# Altium schematic sheet C-05 CPU PERI2.SchDoc
size 513 x 386 mm
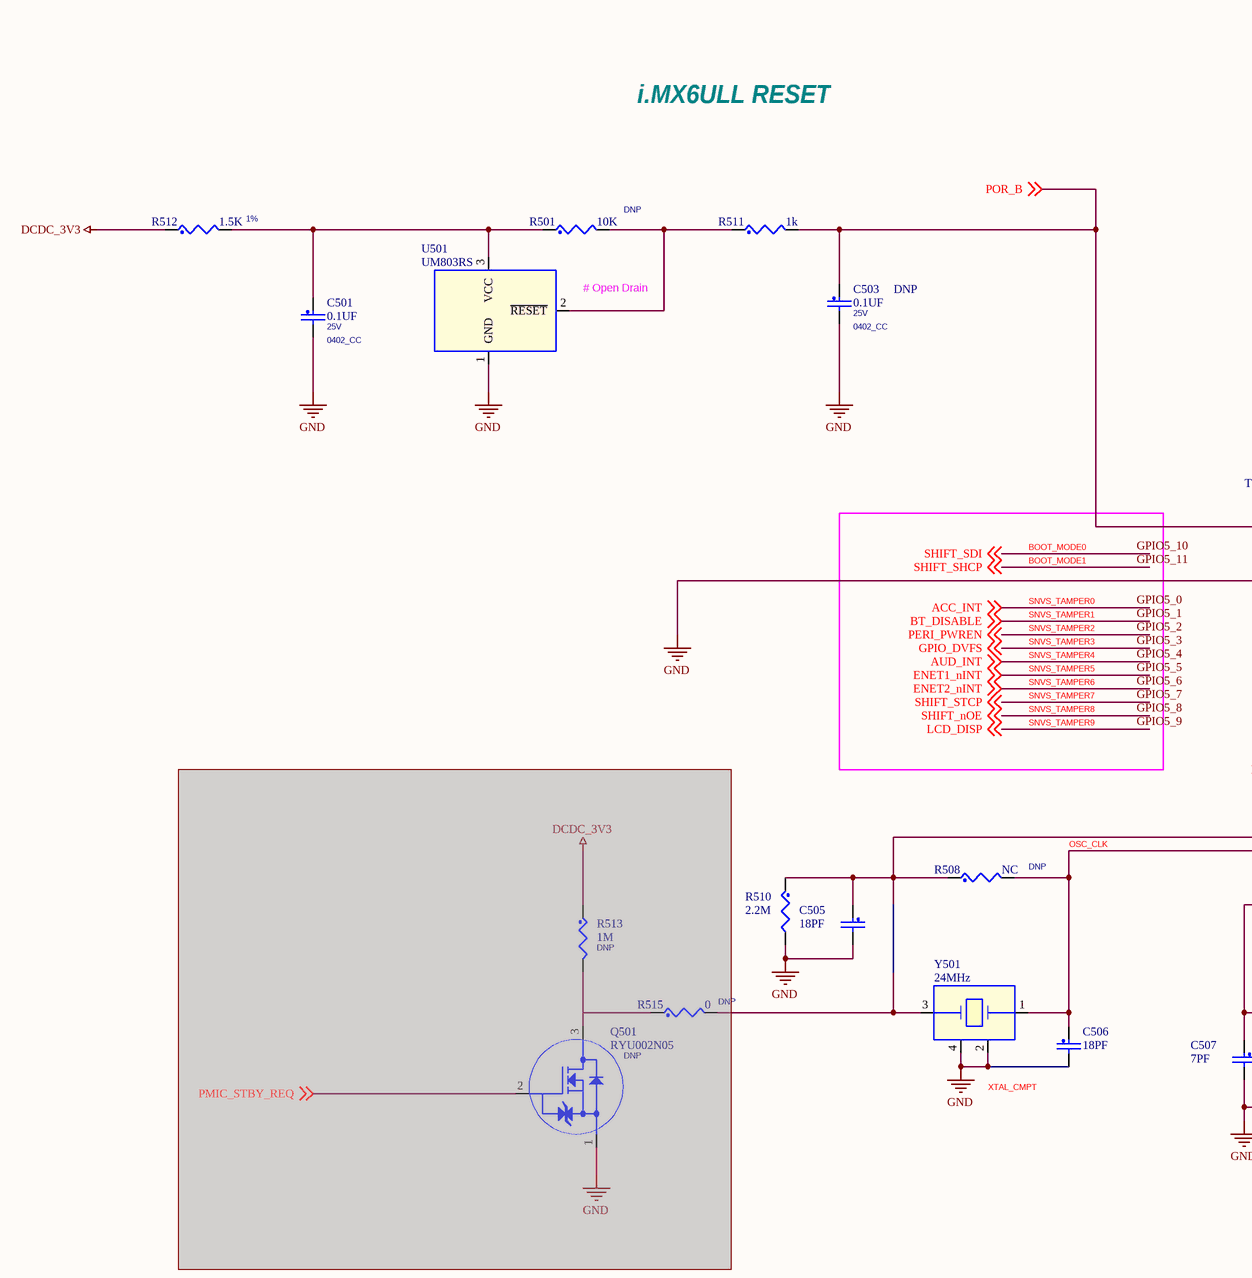
[diagram p0: C-05 CPU PERI2.SchDoc, left]
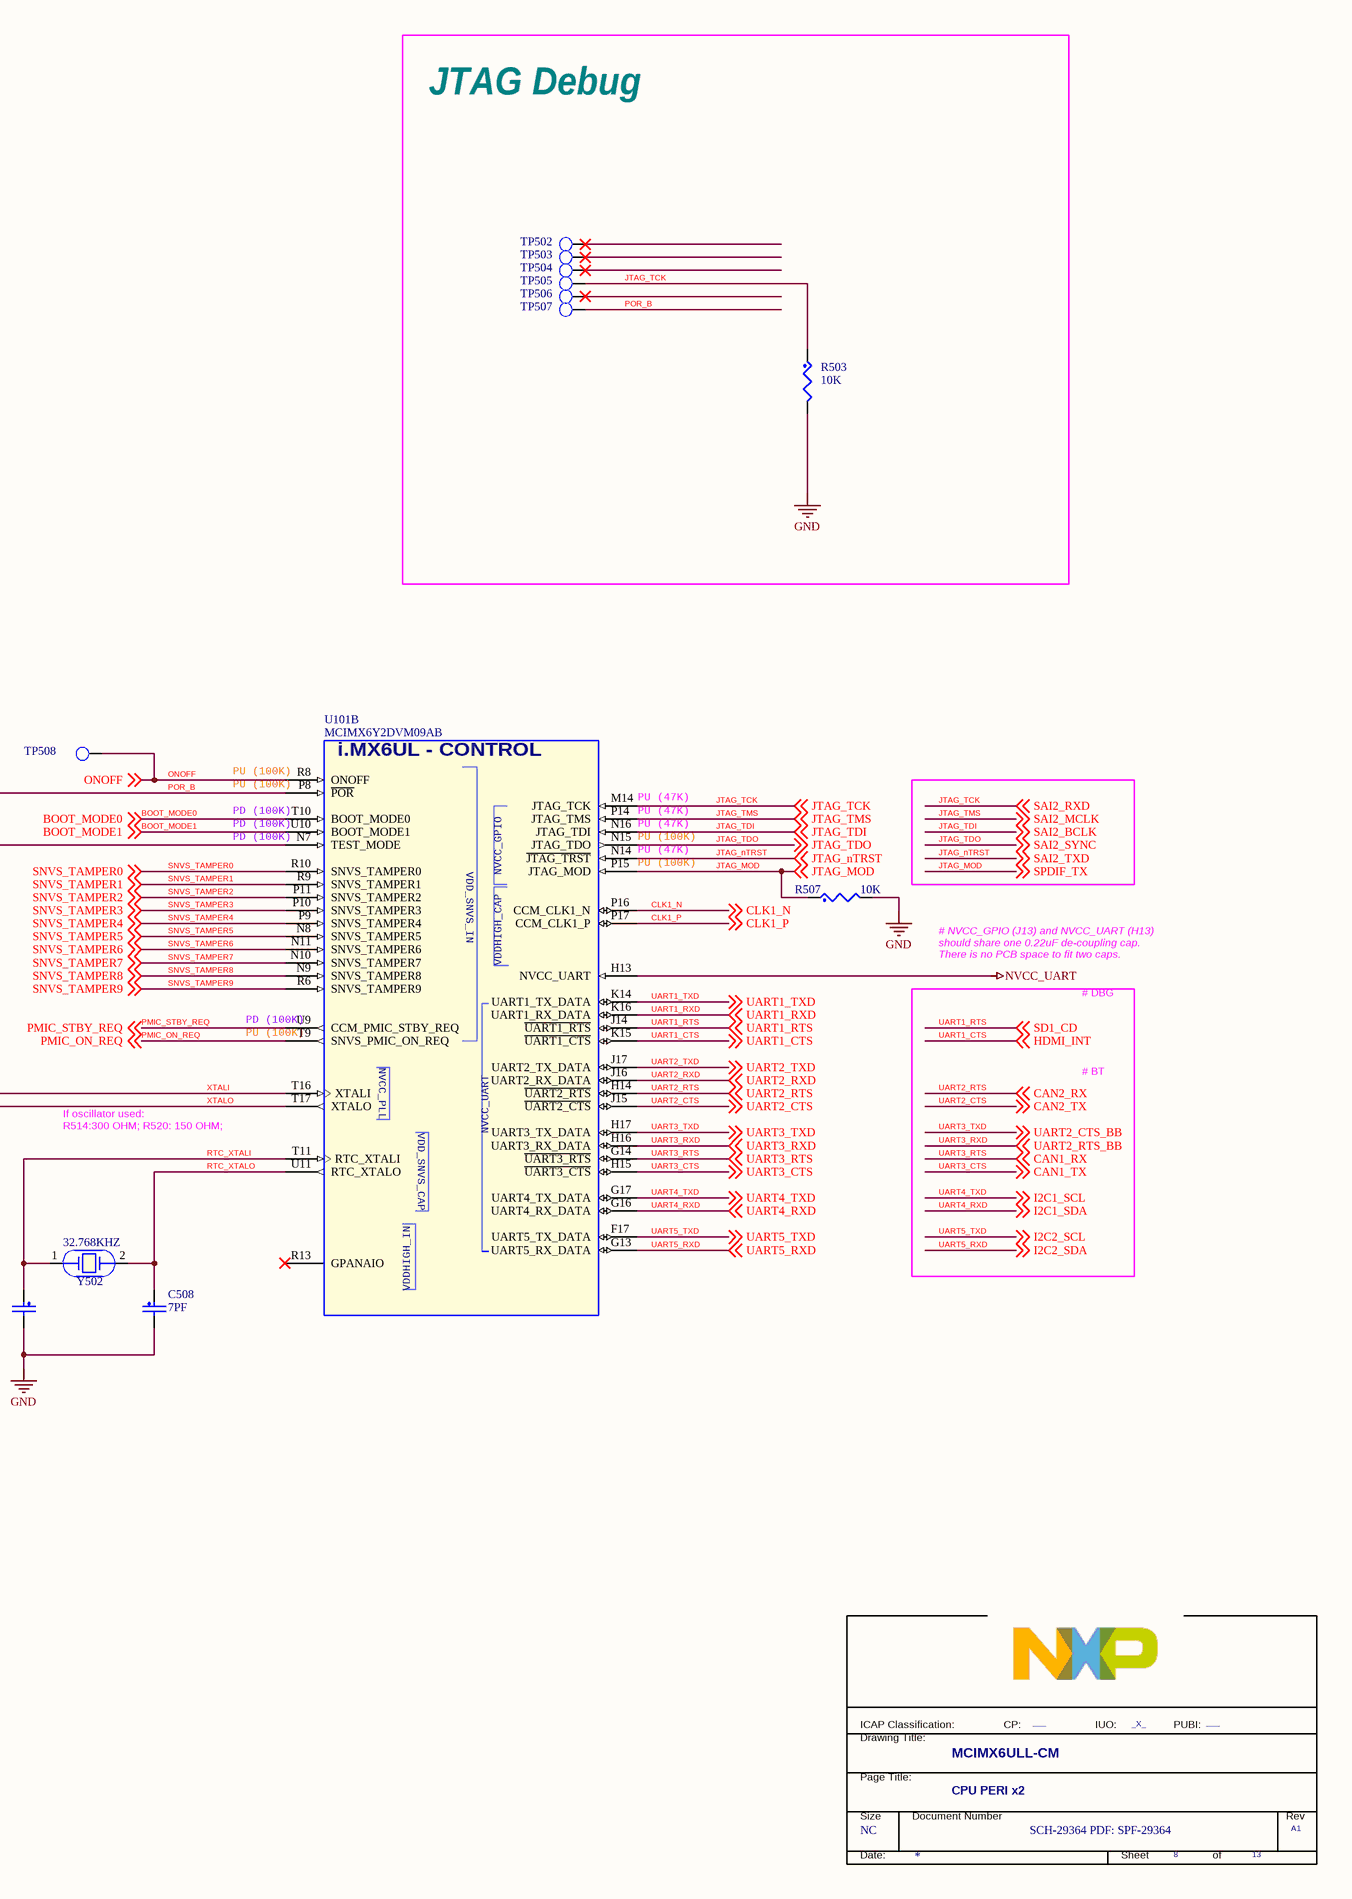
[diagram p1: C-05 CPU PERI2.SchDoc, right]

## Parts
*  PageTitle: CPU PERI x2  Page Count: 13  Page Number: 8  Page Size: NC  Title: MCIMX6ULL-CM  RevCode: A1  Doc: SCH-29364 PDF: SPF-29364  FCP: ___  FIUO: _X_  (hidden comment: TitleBlock_FS)  (graphical)
C501  0.1UF  VOLTAGE: 25V  PCB Footprint: 0402_CC  [0402T_C]
C503  0.1UF  ASSY_OPT: DNP  VOLTAGE: 25V  PCB Footprint: 0402_CC  [0402T_C]
C505  18PF  [0402T_C]
C506  18PF  [0402T_C]
C507  7PF  [0402T_C]
C508  7PF  [0402T_C]
Q501  RYU002N05  ASSY_OPT: DNP  [SOT-23]  (masked out: inside a compile mask, not in the netlist)
R501  10K  ASSY_OPT: DNP  [0402T_C]
R503  10K  [0402T_C]
R507  10K  [0402T_C]
R508  NC  ASSY_OPT: DNP  [0402T_C]
R510  2.2M  [0402T_C]
R511  1k  [0402T_C]
R512  1.5K  Tolerance: 1%  [0402T_C]
R513  1M  ASSY_OPT: DNP  [0402_CC]  (masked out: inside a compile mask, not in the netlist)
R515  0  ASSY_OPT: DNP  [0402_CC]  (masked out: inside a compile mask, not in the netlist)
TP502  TP_35MIL  [testpoint_35mil]  (value not drawn)
TP503  TP_35MIL  [testpoint_35mil]  (value not drawn)
TP504  TP_35MIL  [testpoint_35mil]  (value not drawn)
TP505  TP_35MIL  [testpoint_35mil]  (value not drawn)
TP506  TP_35MIL  [testpoint_35mil]  (value not drawn)
TP507  TP_35MIL  [TPAD_015]  (value not drawn)
TP508  TP_35MIL  [TPAD_015]  (value not drawn)
U101  MCIMX6Y2DVM09AB  [BGA289_0P8_14X14]  (part B of 11)
U501  UM803RS  [sot-23]
Y501  24MHz  [xtlosc4_3p2x2p5mm_sm]
Y502  32.768KHZ  [XTAL2-3p2x1p5-SM]

## Blocks framed on the sheet
JTAG Debug: R503 TP502-TP507

## Nets
DCDC_3V3: R512.1
GND: C501.2 C503.2 C505.2 C506.2 C507.2 C508.2 R503.2 R507.2 R510.2 U101.N7(TEST_MODE) U501.1(GND) Y501.2 Y501.4
NVCC_UART: U101.H13(NVCC_UART)
BOOT_MODE0: U101.T10(BOOT_MODE0) ; off-sheet BOOT_MODE0, off-sheet SHIFT_SDI  [also labelled GPIO5_10, SHIFT_SDI]
BOOT_MODE1: U101.U10(BOOT_MODE1) ; off-sheet BOOT_MODE1, off-sheet SHIFT_SHCP  [also labelled GPIO5_11, SHIFT_SHCP]
CLK1_N: U101.P16(CCM_CLK1_N) ; off-sheet CLK1_N
CLK1_P: U101.P17(CCM_CLK1_P) ; off-sheet CLK1_P
GPIO5_0: U101.R10(SNVS_TAMPER0) ; off-sheet ACC_INT, off-sheet SNVS_TAMPER0  [also labelled ACC_INT, SNVS_TAMPER0]
GPIO5_1: U101.R9(SNVS_TAMPER1) ; off-sheet BT_DISABLE, off-sheet SNVS_TAMPER1  [also labelled BT_DISABLE, SNVS_TAMPER1]
GPIO5_2: U101.P11(SNVS_TAMPER2) ; off-sheet SNVS_TAMPER2, off-sheet PERI_PWREN  [also labelled PERI_PWREN, SNVS_TAMPER2]
GPIO5_3: U101.P10(SNVS_TAMPER3) ; off-sheet SNVS_TAMPER3, off-sheet GPIO_DVFS  [also labelled GPIO_DVFS, SNVS_TAMPER3]
GPIO5_4: U101.P9(SNVS_TAMPER4) ; off-sheet AUD_INT, off-sheet SNVS_TAMPER4  [also labelled AUD_INT, SNVS_TAMPER4]
GPIO5_5: U101.N8(SNVS_TAMPER5) ; off-sheet SNVS_TAMPER5, off-sheet ENET1_nINT  [also labelled ENET1_nINT, SNVS_TAMPER5]
GPIO5_6: U101.N11(SNVS_TAMPER6) ; off-sheet SNVS_TAMPER6, off-sheet ENET2_nINT  [also labelled ENET2_nINT, SNVS_TAMPER6]
GPIO5_7: U101.N10(SNVS_TAMPER7) ; off-sheet SNVS_TAMPER7, off-sheet SHIFT_STCP  [also labelled SHIFT_STCP, SNVS_TAMPER7]
GPIO5_8: U101.N9(SNVS_TAMPER8) ; off-sheet SNVS_TAMPER8, off-sheet SHIFT_nOE  [also labelled SHIFT_nOE, SNVS_TAMPER8]
GPIO5_9: U101.R6(SNVS_TAMPER9) ; off-sheet SNVS_TAMPER9, off-sheet LCD_DISP  [also labelled LCD_DISP, SNVS_TAMPER9]
JTAG_MOD: R507.1 U101.P15(JTAG_MOD) ; off-sheet JTAG_MOD, off-sheet SPDIF_TX  [also labelled SPDIF_TX]
JTAG_nTRST: U101.N14(~{JTAG_TRST}) ; off-sheet SAI2_TXD, off-sheet JTAG_nTRST  [also labelled SAI2_TXD]
JTAG_TCK: R503.1 TP505.1(TP) U101.M14(JTAG_TCK) ; off-sheet SAI2_RXD, off-sheet JTAG_TCK  [also labelled SAI2_RXD]
JTAG_TDI: U101.N16(JTAG_TDI) ; off-sheet SAI2_BCLK, off-sheet JTAG_TDI  [also labelled SAI2_BCLK]
JTAG_TDO: U101.N15(JTAG_TDO) ; off-sheet SAI2_SYNC, off-sheet JTAG_TDO  [also labelled SAI2_SYNC]
JTAG_TMS: U101.P14(JTAG_TMS) ; off-sheet SAI2_MCLK, off-sheet JTAG_TMS  [also labelled SAI2_MCLK]
ONOFF: TP508.1(TP) U101.R8(ONOFF) ; off-sheet ONOFF
OSC_CLK: C506.1 R508.2 U101.T17(XTALO) Y501.1  [also labelled XTALO]
PMIC_ON_REQ: U101.T9(SNVS_PMIC_ON_REQ) ; off-sheet PMIC_ON_REQ
PMIC_STBY_REQ: U101.U9(CCM_PMIC_STBY_REQ) ; off-sheet PMIC_STBY_REQ
POR_B: C503.1 R511.2 TP507.1(TP) U101.P8(~{POR}) ; off-sheet POR_B
RTC_XTALI: C507.1 U101.T11(RTC_XTALI) Y502.1
RTC_XTALO: C508.1 U101.U11(RTC_XTALO) Y502.2
UART1_CTS: U101.K15(~{UART1_CTS}) ; off-sheet HDMI_INT, off-sheet UART1_CTS  [also labelled HDMI_INT]
UART1_RTS: U101.J14(~{UART1_RTS}) ; off-sheet SD1_CD, off-sheet UART1_RTS  [also labelled SD1_CD]
UART1_RXD: U101.K16(UART1_RX_DATA) ; off-sheet UART1_RXD
UART1_TXD: U101.K14(UART1_TX_DATA) ; off-sheet UART1_TXD
UART2_CTS: U101.J15(~{UART2_CTS}) ; off-sheet CAN2_TX, off-sheet UART2_CTS  [also labelled CAN2_TX]
UART2_RTS: U101.H14(~{UART2_RTS}) ; off-sheet CAN2_RX, off-sheet UART2_RTS  [also labelled CAN2_RX]
UART2_RXD: U101.J16(UART2_RX_DATA) ; off-sheet UART2_RXD
UART2_TXD: U101.J17(UART2_TX_DATA) ; off-sheet UART2_TXD
UART3_CTS: U101.H15(~{UART3_CTS}) ; off-sheet CAN1_TX, off-sheet UART3_CTS  [also labelled CAN1_TX]
UART3_RTS: U101.G14(~{UART3_RTS}) ; off-sheet CAN1_RX, off-sheet UART3_RTS  [also labelled CAN1_RX]
UART3_RXD: U101.H16(UART3_RX_DATA) ; off-sheet UART2_RTS_BB, off-sheet UART3_RXD  [also labelled UART2_RTS_BB]
UART3_TXD: U101.H17(UART3_TX_DATA) ; off-sheet UART2_CTS_BB, off-sheet UART3_TXD  [also labelled UART2_CTS_BB]
UART4_RXD: U101.G16(UART4_RX_DATA) ; off-sheet I2C1_SDA, off-sheet UART4_RXD  [also labelled I2C1_SDA]
UART4_TXD: U101.G17(UART4_TX_DATA) ; off-sheet I2C1_SCL, off-sheet UART4_TXD  [also labelled I2C1_SCL]
UART5_RXD: U101.G13(UART5_RX_DATA) ; off-sheet I2C2_SDA, off-sheet UART5_RXD  [also labelled I2C2_SDA]
UART5_TXD: U101.F17(UART5_TX_DATA) ; off-sheet I2C2_SCL, off-sheet UART5_TXD  [also labelled I2C2_SCL]
XTALI: C505.1 R508.1 R510.1 U101.T16(XTALI) Y501.3
NetC501_1: C501.1 R501.1 R512.2 U501.3(VCC)
NetR501_2: R501.2 R511.1 U501.2(~{RESET})

Not connected (* = marked no-connect by the designer): TP502 1(TP)*; TP503 1(TP)*; TP504 1(TP)*; TP506 1(TP)*; U101 R13(GPANAIO)*

## Notes on the sheet
- i.MX6ULL RESET
- (near U501) # Open Drain
- (near U101) PU (100K)
- (near U101) PD (100K)
- (near U101) PU (47K)
- # NVCC_GPIO (J13) and NVCC_UART (H13)
  should share one 0.22uF de-coupling cap.
  There is no PCB space to fit two caps.
- # DBG
- # BT
- If oscillator used:
  R514:300 OHM; R520: 150 OHM;
- Labels drawn without touching a wire or pin: XTAL_CMPT
- (in symbol MCIMX6Y2DVM05AA_PBGA_289P, part B) i.MX6UL - CONTROL; VDDHIGH_CAP; VDDHIGH_IN
- (in symbol TitleBlock_FS) ICAP Classification:; CP:; IUO:; PUBI:; Drawing Title:; Page Title:; Size; Document Number; Rev; Date:; Sheet; of

## Library data of the parts
* = TitleBlock_FS: OrgAddr2: Austin, TX 78735-8598; OrgAddr1: 6501 William Cannon Drive West; OrgName: Freescale Semiconductor; Page Create Date: March  8, 1995; PUBI: ___; Page Modify Date: *
C501 C503 = CAP_NP: CAP CER 0.1UF 25V 10% X5R 0402; CLASS: DISCRETE; FPLIST: CC0402_25,CC0402_HD,0402_CC; CAD_APPROVED: Yes; MFG_PN01: CC0402KRX5R8BB104; MFG_NAME01: YAGEO AMERICA; AGILE_PN: 150-78633; HEIGHT: 0.55MM; ROHS: Yes; Tolerance: 10%
C505 C506 = CAP_NP: CAP CER 18PF 50V 1% C0G 0402; CLASS: DISCRETE; ROOM: ATLAS-AP; PRIORITY_PN: 021-00248; CAD_APPROVED: Yes; MFG_PN01: CC0402FRNPO9BN180; MFG_NAME01: YAGEO; AGILE_PN: 150-76630; FPLIST: CC0402_25,CC0402_HD,0402_CC; PCB Footprint: 0402_CC; VOLTAGE: 50V; HEIGHT: 0.59MM; ROHS: Yes; Tolerance: 1%
C507 C508 = CAP_NP: CAP CER 18PF 50V 1% C0G 0402; CLASS: DISCRETE; FPLIST: CC0402_25,CC0402_HD,0402_CC; AGILE_PN: 150-76630; MFG_NAME01: YAGEO; MFG_PN01: CC0402FRNPO9BN180; CAD_APPROVED: Yes; PRIORITY_PN: 021-00248; ROOM: ATLAS-AP; PCB Footprint: 0402_CC; VOLTAGE: 50V; Tolerance: 1%; ROHS: Yes; HEIGHT: 0.59MM
Q501 = NMOSFET_3P_ESD_DIODE: TRAN NMOS SW 0.9V DRIVE 50V UMT3; CLASS: IC; AGILE_PN: 480-78966; MFG_NAME01: ROHM; CAD_APPROVED: Yes; PCB Footprint: SOT323_3; MFG_PN01: RYU002N05; ROHS: Yes; HEIGHT: 0.9MM
R501 = RES: RES MF ZERO OHM 1/16W 5% 0402; CLASS: DISCRETE; FPLIST: RC0402_25,RC0402_HD,RC0402_X2,0402_CC; CAD_APPROVED: Yes; MFG_PN01: MCR01MZPJ000; MFG_NAME01: ROHM; AGILE_PN: 470-75394; PCB Footprint: 0402_CC; HEIGHT: 0.45 MM; ROHS: Yes; Tolerance: 5%
R503 R507 = RES: RES MF 10K 1/16W 5% 0402; CLASS: DISCRETE; FPLIST: RC0402_25,RC0402_HD,0402_CC; CAD_APPROVED: Yes; MFG_PN01: CRCW040210K0JNED; MFG_NAME01: VISHAY INTERTECHNOLOGY; AGILE_PN: 470-75557; PCB Footprint: 0402_CC; ROHS: Yes; Tolerance: 5%; TOL: 5%; HEIGHT: 0.4 MM
R508 = RES: RES MF 1M 1/10W 5% AEC-Q200 0402; CLASS: DISCRETE; Temp_Range: -55&#8451; to 155&#8451;; FPLIST: RC0402_25,RC0402_HD,0402_CC; CAD_APPROVED: Yes; MFG_PN01: RK73B1ETTP105J; MFG_NAME01: KOA SPEER; AGILE_PN: 470-79978; PCB Footprint: 0402_CC; HEIGHT: 0.4MM; ROHS: Yes; Tolerance: 5%
R510 = RES: RES MF 2.2M 1/10W 1% AEC-Q200 0402; CLASS: DISCRETE; Temp_Range: -55C to +155C; FPLIST: RC0402_25,RC0402_HD,0402_CC; CAD_APPROVED: Yes; MFG_PN01: RK73H1ETTP2204F; MFG_NAME01: KOA SPEER; AGILE_PN: 470-31210; PCB Footprint: 0402_CC; HEIGHT: 0.40 MM; ROHS: Yes; Tolerance: 1%
R511 = RES: RES MF 1.0K 1/16W 5% 0402; CLASS: DISCRETE; AGILE_PN: 470-75555; MFG_NAME01: VISHAY INTERTECHNOLOGY; MFG_PN01: CRCW04021K00JNED; CAD_APPROVED: Yes; FPLIST: RC0402_25,RC0402_HD,RC0402_X2,0402_CC; PCB Footprint: 0402_CC; HEIGHT: 0.41mm; Tolerance: 5%; ROHS: Yes
R512 = RES: RES MF 1.5K 1/16W 1% 0402; CLASS: DISCRETE; AGILE_PN: 470-80487; MFG_NAME01: BOURNS; MFG_PN01: CR0402-FX-1501GLF; CAD_APPROVED: Yes; FPLIST: RC0402_25,RC0402_HD,0402_CC; PCB Footprint: 0402_CC; HEIGHT: 0.4MM; ROHS: Yes
R513 = RES: RES MF 1M 1/10W 5% AEC-Q200 0402; CLASS: DISCRETE; Temp_Range: -55&#8451; to 155&#8451;; AGILE_PN: 470-79978; MFG_NAME01: KOA SPEER; MFG_PN01: RK73B1ETTP105J; CAD_APPROVED: Yes; FPLIST: RC0402_25,RC0402_HD,0402_CC; HEIGHT: 0.4MM; Tolerance: 5%; ROHS: Yes; PCB Footprint: 0402_CC
R515 = RES: RES MF ZERO OHM 1/16W 5% 0402; CLASS: DISCRETE; FPLIST: RC0402_25,RC0402_HD,RC0402_X2,0402_CC; CAD_APPROVED: Yes; MFG_PN01: MCR01MZPJ000; MFG_NAME01: ROHM; AGILE_PN: 470-75394; HEIGHT: 0.45 MM; ROHS: Yes; Tolerance: 5%; PCB Footprint: 0402_CC
TP502-TP506 = T POINT R: TEST POINT PAD .035 SMT, no part to order; CLASS: IC; AGILE_PN: 510-75618; CAD_APPROVED: Yes; ROHS: Yes; HEIGHT: 0.1MM; PCB Footprint: testpoint_35mil
TP507 TP508 = T POINT R: TEST POINT PAD .035 SMT, no part to order; CLASS: IC; AGILE_PN: 510-75618; CAD_APPROVED: Yes; PCB Footprint: testpoint_35mil; ROHS: Yes; HEIGHT: 0.1MM
U101 = MCIMX6Y2DVM05AA_PBGA_289P: IC CPU ARM COREA7 900MHZ 16BIT 3-3.6V PBGA289; AGILE_PN: TMP-WF-33487; MFG_NAME01: NXP SEMICONDUCTORS; Temp_Range: 0C to +95C; PRE_APN: 330-77080; CAD_APPROVED: Yes; CLASS: IC; MFG_PN01: MCIMX6Y2DVM09AB; ROHS: Yes; HEIGHT: 1.32MM; PCB Footprint: BGA289_0P8_14X14
U501 = SGM803_SOT23-3P: IC VOLT MONITOR 2.63V RST VTH 1-5.5V AUTO SOT-23; CAD_APPROVED: Yes; MFG_NAME01: Union Semiconductor, Inc; AGILE_PN: 315-80553; CLASS: IC; HEIGHT: 1.25MM; ROHS: Yes; MFG_PN01: UM803RS; PCB Footprint: sot-23
Y501 = XTAL_13: XTAL 24MHZ -- 30PPM 3.2X2.5MM SMD; CLASS: IC; CAD_APPROVED: Yes; MFG_PN01: 7V24000002; MFG_NAME01: TXC CORP; AGILE_PN: 230-77452; HEIGHT: 0.9MM; ROHS: Yes; PCB Footprint: xtlosc4_3p2x2p5mm_sm
Y502 = XTAL: XTAL 32.768KHZ 12.5pF -- SMT; CLASS: IC; AGILE_PN: 230-77879; MFG_NAME01: Micro Crystal; MFG_PN01: CM7V-T1A, 32.768KHz, 12.5pF, 20ppm, TA, QC; CAD_APPROVED: Yes; ROHS: Yes; HEIGHT: 0.65MM; PCB Footprint: XTAL2-3p2x1p5-SM